# Altium schematic sheet RP2040.SchDoc
size A; SheetNumber: 2; SheetTotal: 4
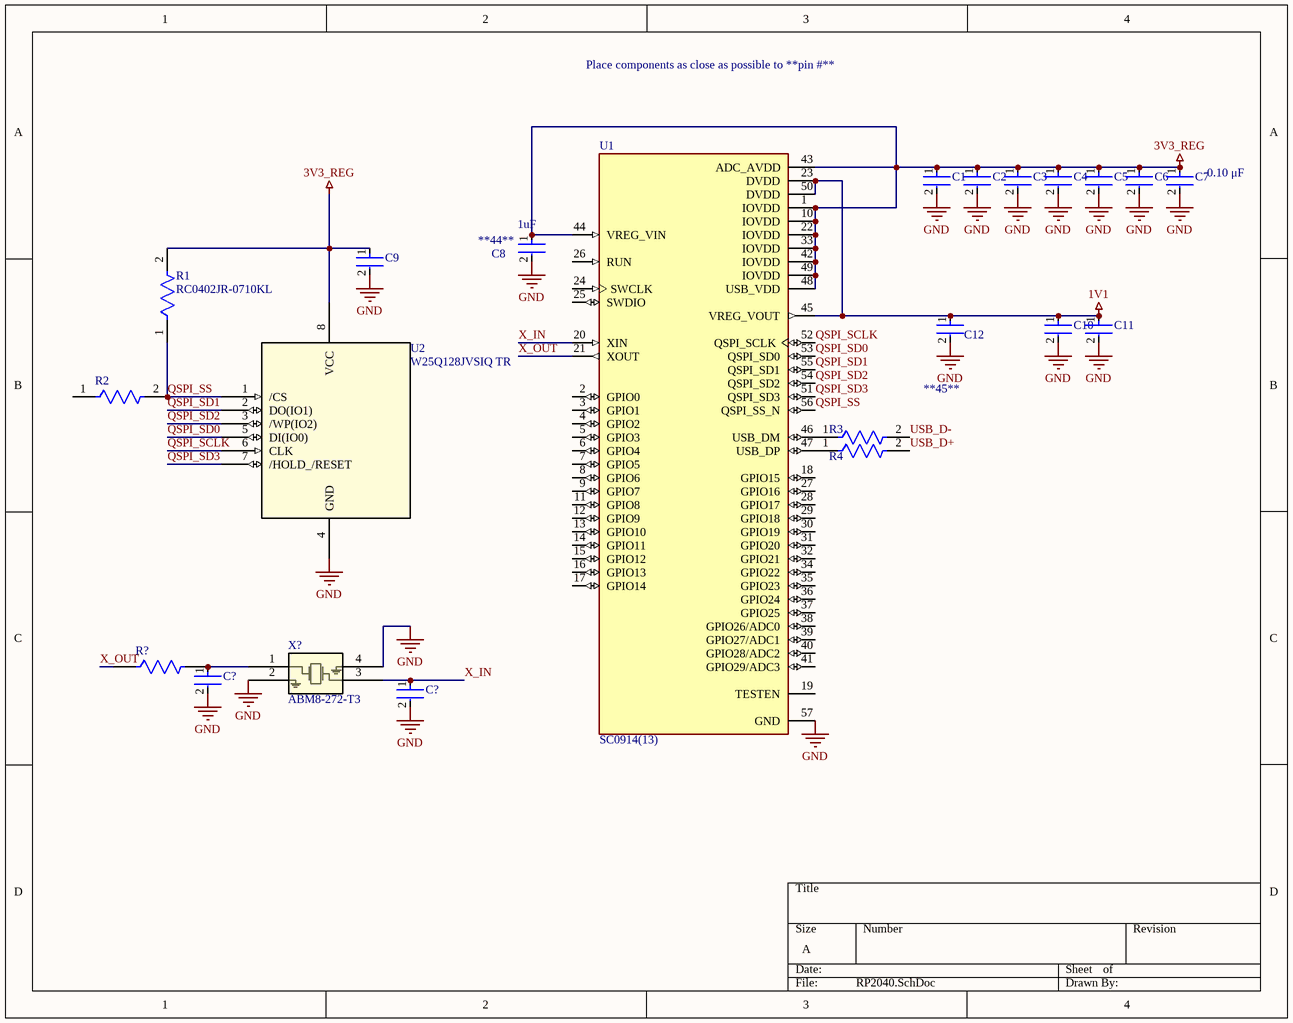
[diagram p0: RP2040.SchDoc]

## Parts
(Parts that share a designator on the sheet are numbered #1, #2 ... from top to bottom, then left to right.)
C1  C0402C104K8PACTU  [FP-C0402-BB-MFG]  (value not drawn)
C2  C0402C104K8PACTU  [FP-C0402-BB-MFG]  (value not drawn)
C3  C0402C104K8PACTU  [FP-C0402-BB-MFG]  (value not drawn)
C4  C0402C104K8PACTU  [FP-C0402-BB-MFG]  (value not drawn)
C5  C0402C104K8PACTU  [FP-C0402-BB-MFG]  (value not drawn)
C6  C0402C104K8PACTU  [FP-C0402-BB-MFG]  (value not drawn)
C7  value 0.10 μF  [FP-C0402-BB-MFG]  (hidden comment: C0402C104K8PACTU)
C8  Capacitance: 1uF  [FP-C0402C105K8PACTU-MFG]  (hidden comment: C0402C105K8PACTU)
C9  C0402C104K8PACTU  [FP-C0402-BB-MFG]  (value not drawn)
C10  C0402C104K8PACTU  [FP-C0402-BB-MFG]  (value not drawn)
C11  C0402C104K8PACTU  [FP-C0402-BB-MFG]  (value not drawn)
C12  C0402C105K8PACTU  [FP-C0402C105K8PACTU-MFG]  (value not drawn)
C?#1  CC0402JRNPO9BN150  [FP-CC0402-0_55-IPC_B]  (value not drawn)
C?#2  CC0402JRNPO9BN150  [FP-CC0402-0_55-IPC_B]  (value not drawn)
R1  RC0402JR-0710KL  [FP-RC0402-0_4-IPC_C]
R2  RC0402FR-071KL  [FP-RC0402-0_4-IPC_A]  (value not drawn)
R3  CRCW060327R4FKEA  [FP-CRCW0603-e3-MFG]  (value not drawn)
R4  CRCW060327R4FKEA  [FP-CRCW0603-e3-MFG]  (value not drawn)
R?  RC0402FR-071KL  [FP-RC0402-0_4-IPC_A]  (value not drawn)
U1  SC0914(13)  [QFN40P700X700X90-57N]
U2  W25Q128JVSIQ TR  [SOIC_208MIL_WIN]
X?  ABM8-272-T3  [ABM8-272-T3_ABR]

## Nets
1V1: C10.1 C11.1 C12.1 U1.23(DVDD) U1.45(VREG_VOUT) U1.50(DVDD)
3V3_REG: C1.1 C2.1 C3.1 C4.1 C5.1 C6.1 C7.1 C8.1 C9.1 R1.2 U1.1(IOVDD) U1.10(IOVDD) U1.22(IOVDD) U1.33(IOVDD) U1.42(IOVDD) U1.43(ADC_AVDD) U1.44(VREG_VIN) U1.48(USB_VDD) U1.49(IOVDD) U2.8(VCC)
GND: C1.2 C2.2 C3.2 C4.2 C5.2 C6.2 C7.2 C8.2 C9.2 C10.2 C11.2 C12.2 C?#1.2 C?#2.2 U1.57(GND) U2.4(GND) X?.2 X?.4
QSPI_SCLK: U1.52(QSPI_SCLK) U2.6(CLK)
QSPI_SD0: U1.53(QSPI_SD0) U2.5(DI(IO0))
QSPI_SD1: U1.55(QSPI_SD1) U2.2(DO(IO1))
QSPI_SD2: U1.54(QSPI_SD2) U2.3(/WP(IO2))
QSPI_SD3: U1.51(QSPI_SD3) U2.7(/HOLD_/RESET)
QSPI_SS: R1.1 R2.2 U1.56(QSPI_SS_N) U2.1(/CS)
USB_D+: R4.2
USB_D-: R3.2
X_IN: C?#2.1 U1.20(XIN) X?.3
X_OUT: R?.1 U1.21(XOUT)
NetC?#1_1: C?#1.1 R?.2 X?.1
NetR3_1: R3.1 U1.46(USB_DM)
NetR4_1: R4.1 U1.47(USB_DP)

Not connected (* = marked no-connect by the designer): R2 1; U1 2(GPIO0) 3(GPIO1) 4(GPIO2) 5(GPIO3) 6(GPIO4) 7(GPIO5) 8(GPIO6) 9(GPIO7) 11(GPIO8) 12(GPIO9) 13(GPIO10) 14(GPIO11) 15(GPIO12) 16(GPIO13) 17(GPIO14) 18(GPIO15) 19(TESTEN) 24(SWCLK) 25(SWDIO) 26(RUN) 27(GPIO16) 28(GPIO17) 29(GPIO18) 30(GPIO19) 31(GPIO20) 32(GPIO21) 34(GPIO22) 35(GPIO23) 36(GPIO24) 37(GPIO25) 38(GPIO26/ADC0) 39(GPIO27/ADC1) 40(GPIO28/ADC2) 41(GPIO29/ADC3)

## Notes on the sheet
- Place components as close as possible to **pin #**
- (near C8) **44**
- **45**

## Library data of the parts
C1-C6 C9-C11 = CMP-2008-02046-2: CAP CER 0.1UF 10V X5R 0402; Manufacturer: Kemet; Material: Ceramic; Capacitance: 0.10 μF; Temperature Coefficient: 15%; Description: C0402 0.10 μF X5R 10.00% 10 V; Tolerance: 0.1; Value: 0.10 μF; Package: C0402-BB; Temperature: -55°C to +125°C; ComponentLink2Description: Datasheet; Temperature Characteristic: X5R; Device Class L1: Passive Components; Height: 0.55mm; Lead Free: Yes; ComponentLink2URL: https://content.kemet.com/datasheets/KEM_C1002_X7R_SMD.pdf; Device Class L2: Capacitors; Temperature Range Low: -55°C; Temperature Range High: +125°C; RoHS: TRUE; Octopart: https://octopart.com/c0402c104k8pactu-kemet-140039; Automotive: No; Mouser Description: Capacitor 100 nF 10 VDC 0402; Category: Cap; Voltage Rating: 10 V; Digikey Description: CAP CER 0.1UF 10V X5R 0402; Ipc Land Pattern Name: CAPC10050X50; Device Class L3: Ceramic Capacitors; Manufacturer Part Number: C0402C104K8PACTU
C7 = CMP-2008-02046-2: CAP CER 0.1UF 10V X5R 0402; Manufacturer: Kemet; Material: Ceramic; Temperature Coefficient: 15%; Description: C0402 0.10 μF X5R 10.00% 10 V; Tolerance: 0.1; Package: C0402-BB; Temperature: -55°C to +125°C; ComponentLink2Description: Datasheet; Capacitance: 0.10 μF; Temperature Characteristic: X5R; Device Class L1: Passive Components; Height: 0.55mm; Lead Free: Yes; ComponentLink2URL: https://content.kemet.com/datasheets/KEM_C1002_X7R_SMD.pdf; Device Class L2: Capacitors; Temperature Range Low: -55°C; Temperature Range High: +125°C; RoHS: TRUE; Octopart: https://octopart.com/c0402c104k8pactu-kemet-140039; Automotive: No; Mouser Description: Capacitor 100 nF 10 VDC 0402; Category: Cap; Voltage Rating: 10 V; Digikey Description: CAP CER 0.1UF 10V X5R 0402; Ipc Land Pattern Name: CAPC10050X50; Device Class L3: Ceramic Capacitors; Manufacturer Part Number: C0402C104K8PACTU
C8 C12 = CMP-2008-02081-2: CAP CER 1UF 10V X5R 0402; Dielectric Material: Ceramic; Dissipation Factor: 5%; Tolerance: 10%; Number of Pins: 2; Contact Plating: Tin; Min Operating Temperature: -55°C; Termination: SMD/SMT; Lead Free: Lead Free; Construction: Flat; Voltage Rating (DC): 10V; Mount: Surface Mount; Series: C; Thickness: 0.022inch; Width: 0.5mm; Radiation Hardening: No; Dielectric: X5R; Height: 0.5mm; Voltage: 10V; Length: 1mm; Depth: 0.5mm; Max Operating Temperature: 85°C; Package Quantity: 1; Packaging: Tape and Reel; RoHS Compliant: Yes; Case Code (Imperial): 0402; Case Code (Metric): 1005; REACH SVHC: No SVHC; Voltage Rating: 10V; Case/Package: 0402
  C12: Capacitance: 1uF
C?#1 C?#2 = CMP-03422-001519-1: CAP CER 15PF 50V C0G/NPO 0402; Insulation Resistance: 100GR; Dielectric Material: Ceramic; Tolerance: 5%; Dielectric: C0G; Width: 0.02inch; Case Code (Imperial): 0402; Voltage Rating (DC): 50V; Case Code (Metric): 1005; REACH SVHC: No SVHC; Mount: Surface Mount; Min Operating Temperature: -55°C; Depth: 0.5mm; Voltage Rating: 50V; Voltage: 50V; Thickness: 0.022inch; Length: 1mm; Max Operating Temperature: 125°C; Lead Free: Lead Free; Capacitance: 15pF; Height: 0.5mm; Packaging: Tape and Reel; Radiation Hardening: No; Package Quantity: 1; Case/Package: 0402; Number of Pins: 2; RoHS Compliant: Yes; Resistor Type: Ceramic; Series: CC; Termination: SMD/SMT
R1 = CMP-2002-07915-3: RES 10K OHM 5% 1/16W 0402; Max Power Dissipation: 63mW; Temperature Coefficient: 100ppm/°C; Power Rating: 62.5mW; Resistance: 10kR; Voltage Rating: 50V; Size Code: 0402; Resistance Tolerance: 5%; Packaging: Tape and Reel; Case Code (Metric): 1005; Lead Free: Lead Free; Resistor Type: Thick Film; Min Operating Temperature: -55°C; Military Standard: Not; Depth: 0.5mm; Series: RC; Case/Package: 0402; Construction: Rectangular; Number of Terminations: 2; Package Quantity: 1; Termination: SMD/SMT; Length: 0.039inch; Case Code (Imperial): 0402; Height: 0.016inch; Features: Moisture Resistant; RoHS Compliant: Yes; Max Operating Temperature: 155°C; Tolerance: 5%; Width: 0.02inch
R2 R? = CMP-2002-07472-3: RES 1K OHM 1% 1/16W 0402; Max Power Dissipation: 63mW; Resistance: 1kR; Voltage Rating (DC): 50V; Temperature Coefficient: 100ppm/°C; Power Rating: 62.5mW; Technology: THICK FILM; Size Code: 0402; Series: RC; Length: 1mm; Case/Package: 0402; Features: Moisture Resistant; Termination: SMD/SMT; Case Code (Metric): 1005; Reach SVHC Compliant: Yes; Number of Terminations: 2; Tolerance: 1%; Lead Free: Lead Free; Military Standard: Not; Resistor Type: Thick Film; Max Operating Temperature: 155°C; RoHS Compliant: Yes; Construction: Rectangular; Voltage Rating: 50V; Packaging: Tape and Reel; Height: 0.32mm; Number of Pins: 2; Resistance Tolerance: 1%; Case Code (Imperial): 0402; Depth: 0.5mm; Min Operating Temperature: -55°C; Width: 0.5mm
R3 R4 = CMP-2000-03146-2: RES Thick Film, 27.4Ω, 1%, 0.1W, 100ppm/°C, 0603; Voltage Rating (DC): 75V; Max Power Dissipation: 100mW; Resistance: 27.4R; Case Code (Metric): 1608; Length: 1.55mm; Depth: 0.85mm; Package Quantity: 10; Voltage Rating: 75V; Power Rating: 100mW; Weight: 7.1E-05oz; Max Operating Temperature: 155°C; Temperature Coefficient: 100ppm/°C; Packaging: Tape and Reel; Lead Free: Lead Free; Number of Pins: 2; Height: 0.45mm; Military Standard: Not; Features: Automotive AEC-Q200; Contact Plating: Tin; Min Operating Temperature: -55°C; Composition: Thick Film; Mount: Surface Mount; Case/Package: 0603; Case Code (Imperial): 0603; Tolerance: 1%; Width: 0.85mm; Radiation Hardening: No; Number of Terminations: 2; Termination: SMD/SMT
U1 = SC0914(13): ARMÂ® CortexÂ®-M0+ - Microcontroller IC 32-Bit Dual-Core 133MHz External Program Memory 56-QFN (7x7); MF: Raspberry Pi; SnapEDA_Link: https://www.snapeda.com/parts/SC0914(13)/Raspberry+Pi/view-part/?ref=snap; Package: VFQFN-56 Raspberry Pi; Value: *; MP: SC0914(13); Check_prices: https://www.snapeda.com/parts/SC0914(13)/Raspberry+Pi/view-part/?ref=eda
U2 = W25Q128JVSIQ TR: No Description Available; Mfr_Name: Winbond; RefDes: RefDes; Type: Type
X? = ABM8-272-T3: No Description Available; Mfr_Name: Abracon; Type: Crystals; RefDes: RefDes